# EAGLE schematic japon (EAGLE 7.6.0)
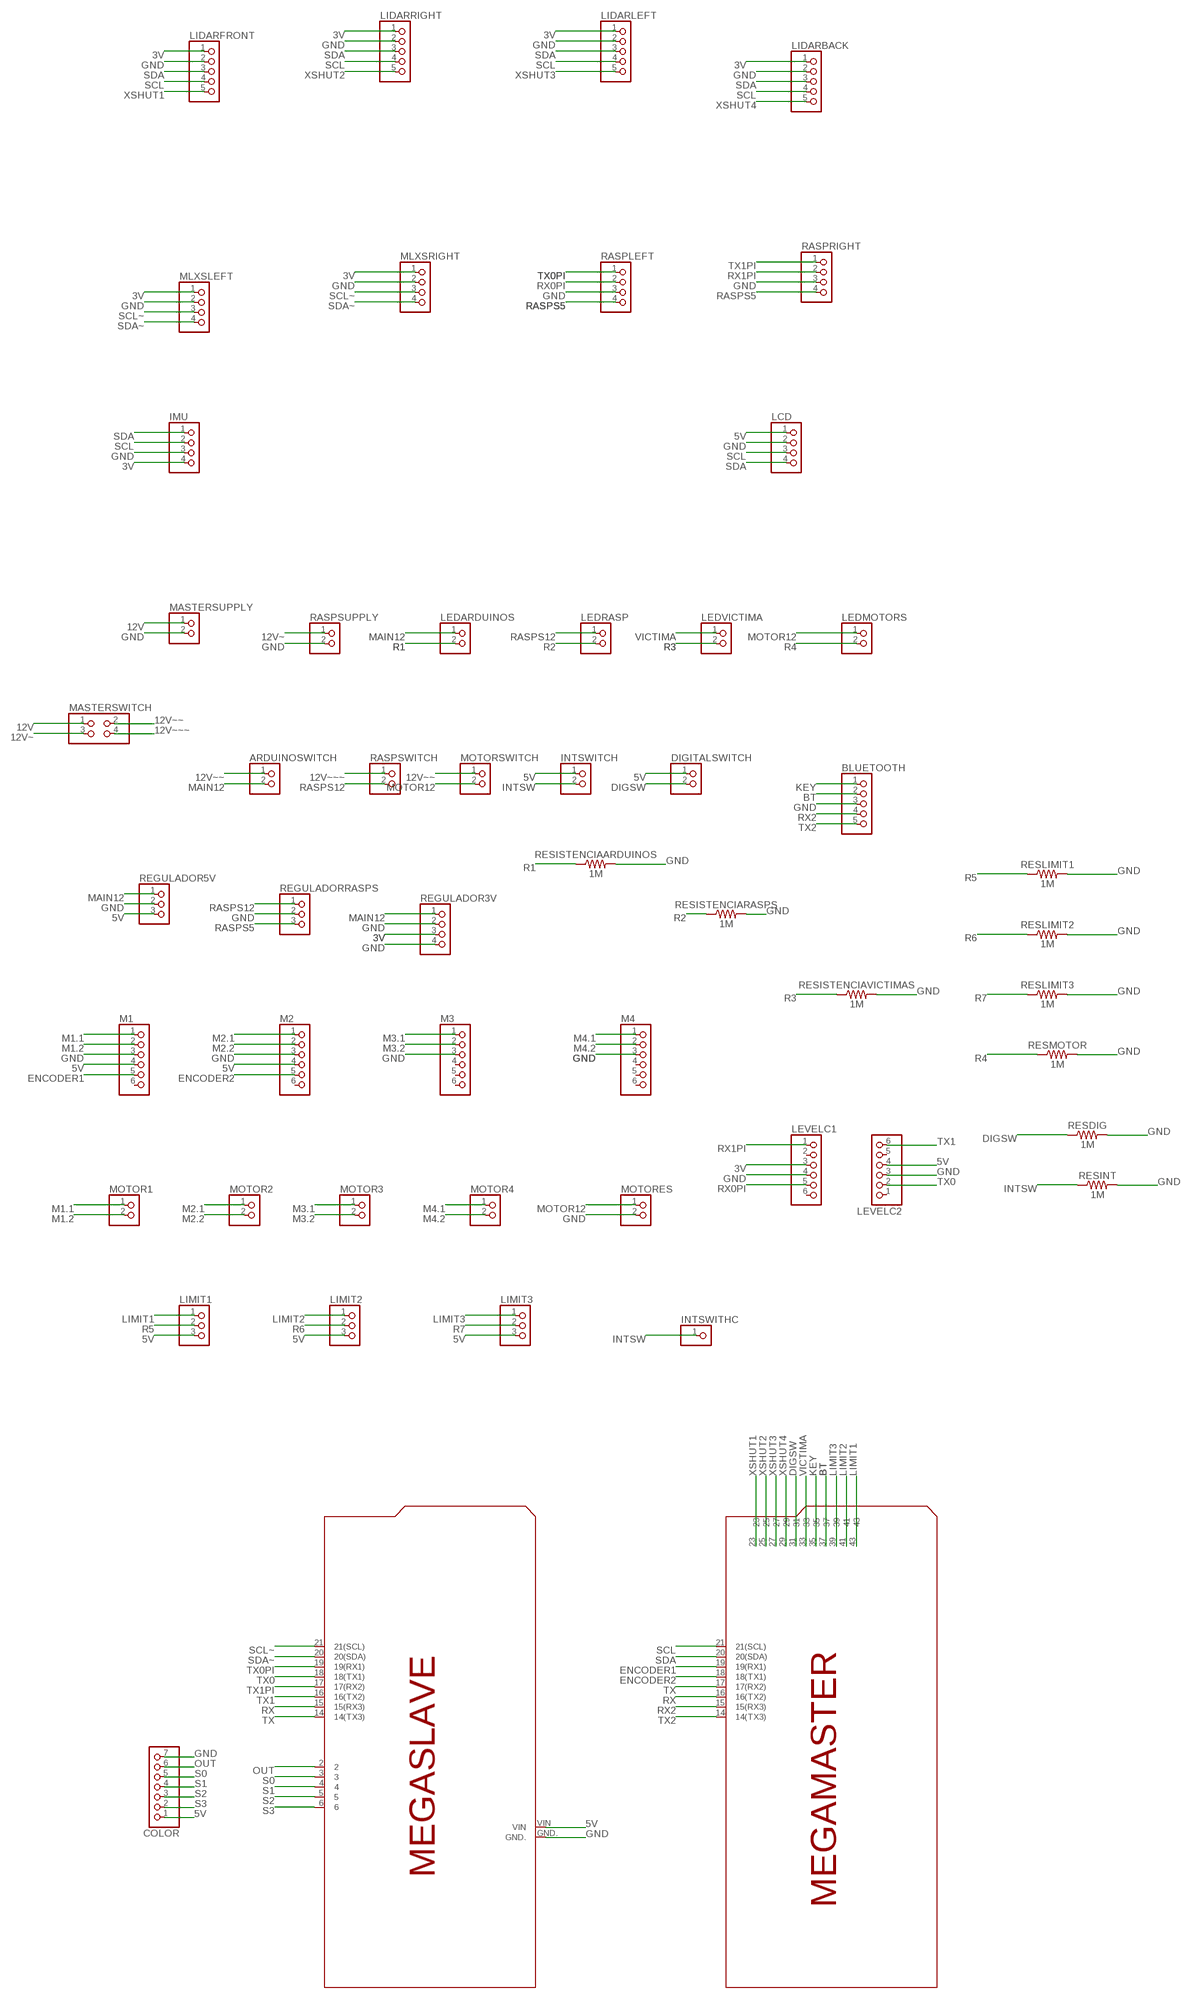
[diagram p0: schematic, sheet 1]

## Parts
ARDUINOSWITCH  PINHD-1X2  [1X02]
BLUETOOTH  PINHD-1X5  [1X05]
COLOR  PINHD-1X7  [1X07]
DIGITALSWITCH  PINHD-1X2  [1X02]
IMU  PINHD-1X4  [1X04]
INTSWITCH  PINHD-1X2  [1X02]
INTSWITHC  PINHD-1X1  [1X01]
LCD  PINHD-1X4  [1X04]
LEDARDUINOS  PINHD-1X2  [1X02]
LEDMOTORS  PINHD-1X2  [1X02]
LEDRASP  PINHD-1X2  [1X02]
LEDVICTIMA  PINHD-1X2  [1X02]
LEVELC1  PINHD-1X6  [1X06]
LEVELC2  PINHD-1X6  [1X06]
LIDARBACK  PINHD-1X5  [1X05]
LIDARFRONT  PINHD-1X5  [1X05]
LIDARLEFT  PINHD-1X5  [1X05]
LIDARRIGHT  PINHD-1X5  [1X05]
LIMIT1  PINHD-1X3  [1X03]
LIMIT2  PINHD-1X3  [1X03]
LIMIT3  PINHD-1X3  [1X03]
M1  PINHD-1X6  [1X06]
M2  PINHD-1X6  [1X06]
M3  PINHD-1X6  [1X06]
M4  PINHD-1X6  [1X06]
MASTERSUPPLY  PINHD-1X2  [1X02]
MASTERSWITCH  PINHD-2X2  [2X02]
MLXSLEFT  PINHD-1X4  [1X04]
MLXSRIGHT  PINHD-1X4  [1X04]
MOTOR1  PINHD-1X2  [1X02]
MOTOR2  PINHD-1X2  [1X02]
MOTOR3  PINHD-1X2  [1X02]
MOTOR4  PINHD-1X2  [1X02]
MOTORES  PINHD-1X2  [1X02]
MOTORSWITCH  PINHD-1X2  [1X02]
RASPLEFT  PINHD-1X4  [1X04]
RASPRIGHT  PINHD-1X4  [1X04]
RASPSUPPLY  PINHD-1X2  [1X02]
RASPSWITCH  PINHD-1X2  [1X02]
REGULADOR3V  PINHD-1X4  [1X04]
REGULADOR5V  PINHD-1X3  [1X03]
REGULADORRASPS  PINHD-1X3  [1X03]
RESDIG  1M  1MOHM-HORIZ-1/6W-5%  [AXIAL-0.3]
RESINT  1M  1MOHM-HORIZ-1/6W-5%  [AXIAL-0.3]
RESISTENCIAARDUINOS  1M  1MOHM-HORIZ-1/6W-5%  [AXIAL-0.3]
RESISTENCIARASPS  1M  1MOHM-HORIZ-1/6W-5%  [AXIAL-0.3]
RESISTENCIAVICTIMAS  1M  1MOHM-HORIZ-1/6W-5%  [AXIAL-0.3]
RESLIMIT1  1M  1MOHM-HORIZ-1/6W-5%  [AXIAL-0.3]
RESLIMIT2  1M  1MOHM-HORIZ-1/6W-5%  [AXIAL-0.3]
RESLIMIT3  1M  1MOHM-HORIZ-1/6W-5%  [AXIAL-0.3]
RESMOTOR  1M  1MOHM-HORIZ-1/6W-5%  [AXIAL-0.3]
U$2  ARDUINOSLAVE  [ARDUINSLAVE]
U$5  ARDUINOMASTER  [ARDUINOMASTER]

## Nets
3V: IMU.4 LEVELC1.3 LIDARBACK.1 LIDARFRONT.1 LIDARLEFT.1 LIDARRIGHT.1 MLXSLEFT.1 MLXSRIGHT.1 REGULADOR3V.3
5V: COLOR.1 DIGITALSWITCH.1 INTSWITCH.1 LCD.1 LEVELC2.4 LIMIT1.3 LIMIT2.3 LIMIT3.3 M1.4 M2.4 REGULADOR5V.3 U$2.VIN
12V: MASTERSUPPLY.1 MASTERSWITCH.1
12V~: MASTERSWITCH.3 RASPSUPPLY.1
12V~~: ARDUINOSWITCH.1 MASTERSWITCH.2 MOTORSWITCH.1
12V~~~: MASTERSWITCH.4 RASPSWITCH.1
BT: BLUETOOTH.2 U$5.37
DIGSW: DIGITALSWITCH.2 RESDIG.P$1 U$5.31
ENCODER1: M1.5 U$5.19(19(RX1))
ENCODER2: M2.5 U$5.18(18(TX1))
GND: BLUETOOTH.3 COLOR.7 IMU.3 LCD.2 LEVELC1.4 LEVELC2.3 LIDARBACK.2 LIDARFRONT.2 LIDARLEFT.2 LIDARRIGHT.2 M1.3 M2.3 M3.3 M4.3 MASTERSUPPLY.2 MLXSLEFT.2 MLXSRIGHT.2 MOTORES.2 RASPLEFT.3 RASPRIGHT.3 RASPSUPPLY.2 REGULADOR3V.2 REGULADOR3V.4 REGULADOR5V.2 REGULADORRASPS.2 RESDIG.P$2 RESINT.P$2 RESISTENCIAARDUINOS.P$2 RESISTENCIARASPS.P$2 RESISTENCIAVICTIMAS.P$2 RESLIMIT1.P$2 RESLIMIT2.P$2 RESLIMIT3.P$2 RESMOTOR.P$2 U$2.GND.
INTSW: INTSWITCH.2 INTSWITHC.1 RESINT.P$1
KEY: BLUETOOTH.1 U$5.35
LIMIT1: LIMIT1.1 U$5.43
LIMIT2: LIMIT2.1 U$5.41
LIMIT3: LIMIT3.1 U$5.39
M1.1: M1.1 MOTOR1.1
M1.2: M1.2 MOTOR1.2
M2.1: M2.1 MOTOR2.1
M2.2: M2.2 MOTOR2.2
M3.1: M3.1 MOTOR3.1
M3.2: M3.2 MOTOR3.2
M4.1: M4.1 MOTOR4.1
M4.2: M4.2 MOTOR4.2
MAIN12: ARDUINOSWITCH.2 LEDARDUINOS.1 REGULADOR3V.1 REGULADOR5V.1
MOTOR12: LEDMOTORS.1 MOTORES.1 MOTORSWITCH.2
OUT: COLOR.6 U$2.2
R1: LEDARDUINOS.2 RESISTENCIAARDUINOS.P$1
R2: LEDRASP.2 RESISTENCIARASPS.P$1
R3: LEDVICTIMA.2 RESISTENCIAVICTIMAS.P$1
R4: LEDMOTORS.2 RESMOTOR.P$1
R5: LIMIT1.2 RESLIMIT1.P$1
R6: LIMIT2.2 RESLIMIT2.P$1
R7: LIMIT3.2 RESLIMIT3.P$1
RASPS5: RASPLEFT.4 RASPRIGHT.4 REGULADORRASPS.3
RASPS12: LEDRASP.1 RASPSWITCH.2 REGULADORRASPS.1
RX: U$2.15(15(RX3)) U$5.16(16(TX2))
RX0PI: LEVELC1.5 RASPLEFT.2
RX1PI: LEVELC1.1 RASPRIGHT.2
RX2: BLUETOOTH.4 U$5.15(15(RX3))
S0: COLOR.5 U$2.3
S1: COLOR.4 U$2.4
S2: COLOR.3 U$2.5
S3: COLOR.2 U$2.6
SCL: IMU.2 LCD.3 LIDARBACK.4 LIDARFRONT.4 LIDARLEFT.4 LIDARRIGHT.4 U$5.21(21(SCL))
SCL~: MLXSLEFT.3 MLXSRIGHT.3 U$2.21(21(SCL))
SDA: IMU.1 LCD.4 LIDARBACK.3 LIDARFRONT.3 LIDARLEFT.3 LIDARRIGHT.3 U$5.20(20(SDA))
SDA~: MLXSLEFT.4 MLXSRIGHT.4 U$2.20(20(SDA))
TX: U$2.14(14(TX3)) U$5.17(17(RX2))
TX0: LEVELC2.2 U$2.18(18(TX1))
TX0PI: RASPLEFT.1 U$2.19(19(RX1))
TX1: LEVELC2.6 U$2.16(16(TX2))
TX1PI: RASPRIGHT.1 U$2.17(17(RX2))
TX2: BLUETOOTH.5 U$5.14(14(TX3))
VICTIMA: LEDVICTIMA.1 U$5.33
XSHUT1: LIDARFRONT.5 U$5.23
XSHUT2: LIDARRIGHT.5 U$5.25
XSHUT3: LIDARLEFT.5 U$5.27
XSHUT4: LIDARBACK.5 U$5.29
Unconnected: LEVELC1.2 LEVELC1.6 LEVELC2.1 LEVELC2.5 M1.6 M2.6 M3.4 M3.5 M3.6 M4.4 M4.5 M4.6

## Library data of the parts
ARDUINOSWITCH DIGITALSWITCH INTSWITCH LEDARDUINOS LEDMOTORS LEDRASP LEDVICTIMA MASTERSUPPLY MOTOR1-MOTOR4 MOTORES MOTORSWITCH RASPSUPPLY RASPSWITCH = pinhead:PINHD-1X2: PIN HEADER
BLUETOOTH LIDARBACK LIDARFRONT LIDARLEFT LIDARRIGHT = pinhead:PINHD-1X5: PIN HEADER
COLOR = pinhead:PINHD-1X7: PIN HEADER
IMU LCD MLXSLEFT MLXSRIGHT RASPLEFT RASPRIGHT REGULADOR3V = pinhead:PINHD-1X4: PIN HEADER
INTSWITHC = pinhead:PINHD-1X1: PIN HEADER
LEVELC1 LEVELC2 M1-M4 = pinhead:PINHD-1X6: PIN HEADER
LIMIT1-LIMIT3 REGULADOR5V REGULADORRASPS = pinhead:PINHD-1X3: PIN HEADER
MASTERSWITCH = pinhead:PINHD-2X2: PIN HEADER
RESDIG RESINT RESISTENCIAARDUINOS RESISTENCIARASPS RESISTENCIAVICTIMAS RESLIMIT1-RESLIMIT3 RESMOTOR = SparkFun-Resistors:1MOHM: 1MΩ resistor A resistor is a passive two-terminal electrical component that implements electrical resistance as a circuit element. Resistors act to reduce current flow, and, at the same time, act to lower voltage levels within circuits. - Wikipedia; PROD_ID: RES-09559
U$2 = E14_Arduino_revC:ARDUINOSLAVE
U$5 = E14_Arduino_revC:ARDUINOMASTER